# Altium schematic sheet dartCounter.SchDoc
size A4
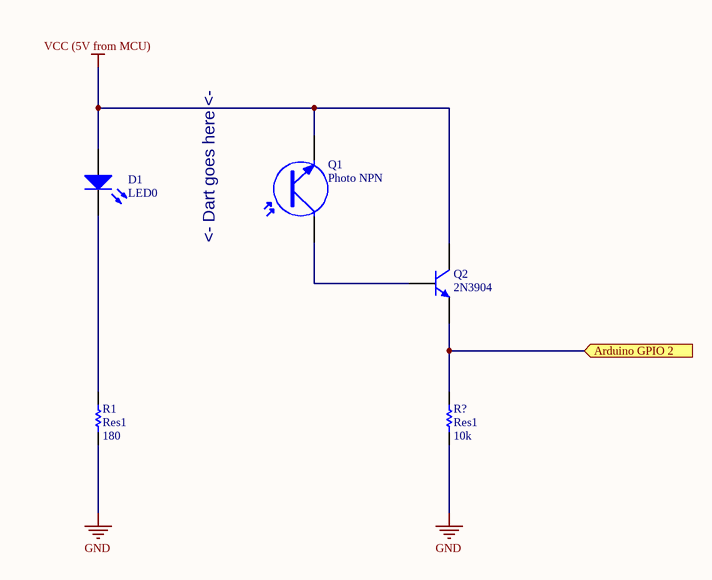
[diagram p0: dartCounter.SchDoc]

## Parts
D1  LED0  [LED-0]
Q1  Photo NPN  [TO-220_A]
Q2  2N3904  [TO-92A]
R1  Res1  value 180  [AXIAL-0.3]
R?  Res1  value 10k  [AXIAL-0.3]

## Ports
Arduino GPIO 2

## Nets
GND: R1.1 R?.1
VCC (5V from MCU): D1.1(A) Q1.3(E) Q2.3(C)
Arduino GPIO 2: Q2.1(E) R?.2 ; port Arduino GPIO 2
NetD1_2: D1.2(K) R1.2
NetQ1_1: Q1.1(C) Q2.2(B)

## Notes on the sheet
- <- Dart goes here <-

## Library data of the parts
D1 = LED0: Typical INFRARED GaAs LED; Published: 8-Jun-2000; LatestRevisionDate: 08-Jul-2005; LatestRevisionNote: Mech Layer 1 removed.; PackageReference: LED-0; Publisher: Altium Limited; PackageDescription: LED; 2 Leads
Q1 = Photo NPN: NPN Phototransistor; Published: 24-Mar-1999; LatestRevisionDate: 17-Jul-2002; LatestRevisionNote: Re-released for DXP Platform.; PackageReference: TO-220_A; Publisher: Altium Limited; Code_JEDEC: TO-220-AC
Q2 = 2N3904: NPN General Purpose Amplifier; Published: 8-Jun-2000; LatestRevisionDate: 15-Jan-2003; LatestRevisionNote: PCB Footprint 'BCY-W3/D4.7' replaced; DatasheetVersion: 1997; PackageVersion: Sep-1998; PackageReference: TO-92A; Publisher: Altium Limited; PackageDescription: TO, Flat Index; 3 In-Line, Axial Leads; Body Dia. 4.5mm; Leads 0.51 x 0.48 mm (max); ComponentLink1Description: Manufacturer Link; ComponentLink1URL: http://www.fairchildsemi.com/; ComponentLink2Description: Datasheet; ComponentLink2URL: http://www.fairchildsemi.com/ds/2N%2F2N3904.pdf
R1 R? = Res1: Resistor; Published: 8-Jun-2000; LatestRevisionDate: 17-Jul-2002; LatestRevisionNote: Re-released for DXP Platform.; PackageReference: AXIAL-0.3; Publisher: Altium Limited; PackageDescription: Axial Device, Thru-Hole; 2 Leads; 0.3 in Pin Spacing